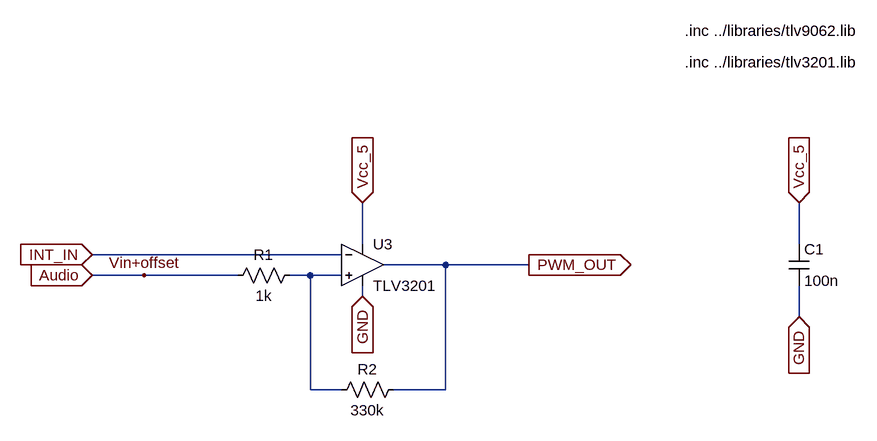
[diagram p0: schematic PWM_modulator_component.asc]
PWM_modulator_component.asc, the LTspice schematic file:
Version 4
SHEET 1 1432 836
WIRE 48 288 48 224
WIRE 720 288 720 224
WIRE 16 304 -368 304
WIRE 176 320 80 320
WIRE 304 320 176 320
WIRE -288 336 -368 336
WIRE -144 336 -288 336
WIRE -32 336 -64 336
WIRE 16 336 -32 336
WIRE 48 368 48 352
WIRE 720 400 720 352
WIRE -32 512 -32 336
WIRE 16 512 -32 512
WIRE 176 512 176 320
WIRE 176 512 96 512
FLAG 48 224 Vcc_5
IOPIN 48 224 In
FLAG -368 304 INT_IN
IOPIN -368 304 In
FLAG -368 336 Audio
IOPIN -368 336 In
FLAG 304 320 PWM_OUT
IOPIN 304 320 Out
FLAG -288 336 Vin+offset
FLAG 48 368 GND
IOPIN 48 368 In
FLAG 720 224 Vcc_5
IOPIN 720 224 In
FLAG 720 400 GND
IOPIN 720 400 In
SYMBOL OpAmps\\opamp2 48 256 R0
SYMATTR InstName U3
SYMATTR Value TLV3201
SYMBOL cap 704 288 R0
SYMATTR InstName C1
SYMATTR Value 100n
SYMBOL res -48 320 R90
WINDOW 0 0 56 VBottom 2
WINDOW 3 32 56 VTop 2
SYMATTR InstName R1
SYMATTR Value 1k
SYMBOL res 112 496 R90
WINDOW 0 0 56 VBottom 2
WINDOW 3 32 56 VTop 2
SYMATTR InstName R2
SYMATTR Value 330k
TEXT 544 -40 Left 2 !.inc ../libraries/tlv9062.lib
TEXT 544 8 Left 2 !.inc ../libraries/tlv3201.lib

The netlist it stands for:
* PWM_modulator_component.asc
XU3 N001 INT_IN Vcc_5 GND PWM_OUT TLV3201  ; pins In+ In- V+ V- OUT
C1 Vcc_5 GND 100n
R1 N001 Vin+offset 1k
R2 PWM_OUT N001 330k
.inc ../libraries/tlv9062.lib
.inc ../libraries/tlv3201.lib
.backanno
.end